# Altium project PCB_Project.PrjPcb (part 2 of 2)

## Sheet Main_Power.SchDoc
size A1; Organization: Protel International P/L; Address1: L3, 12a Rodborough Rd; Address2: Frenchs Forest; Address3: NSW; Address4: Australia 2086
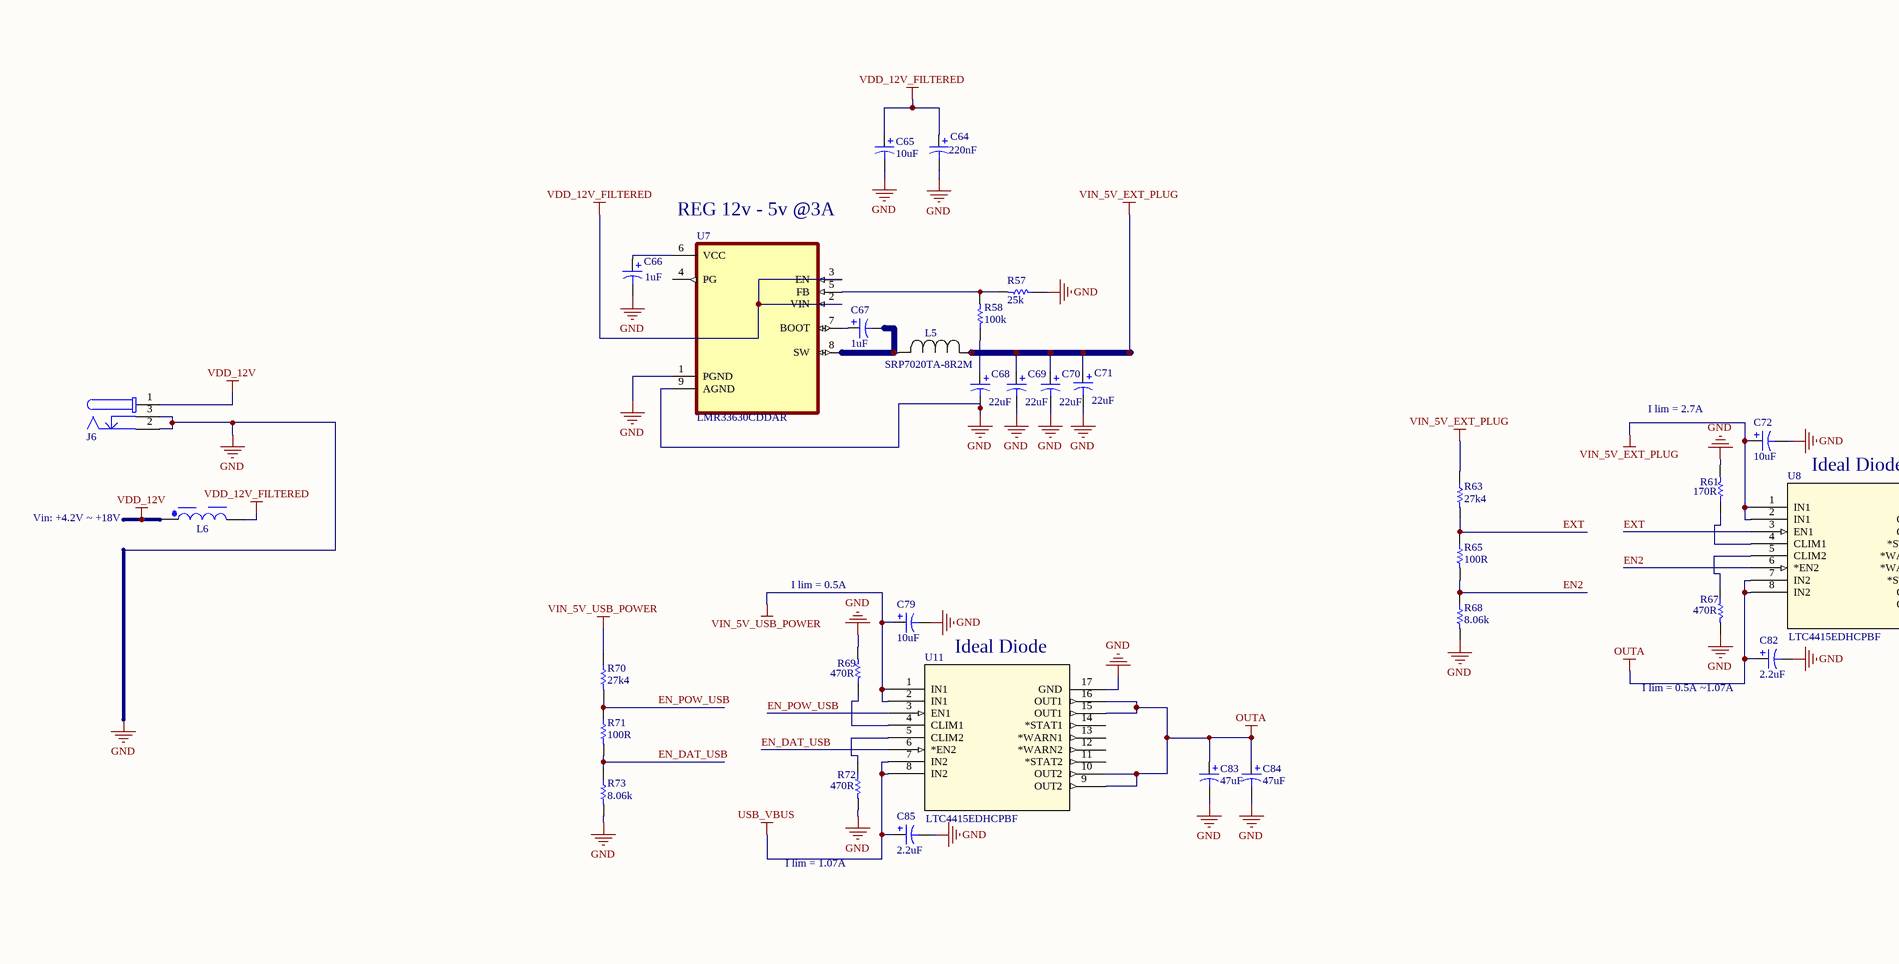
[diagram p7: Main_Power.SchDoc, top left]
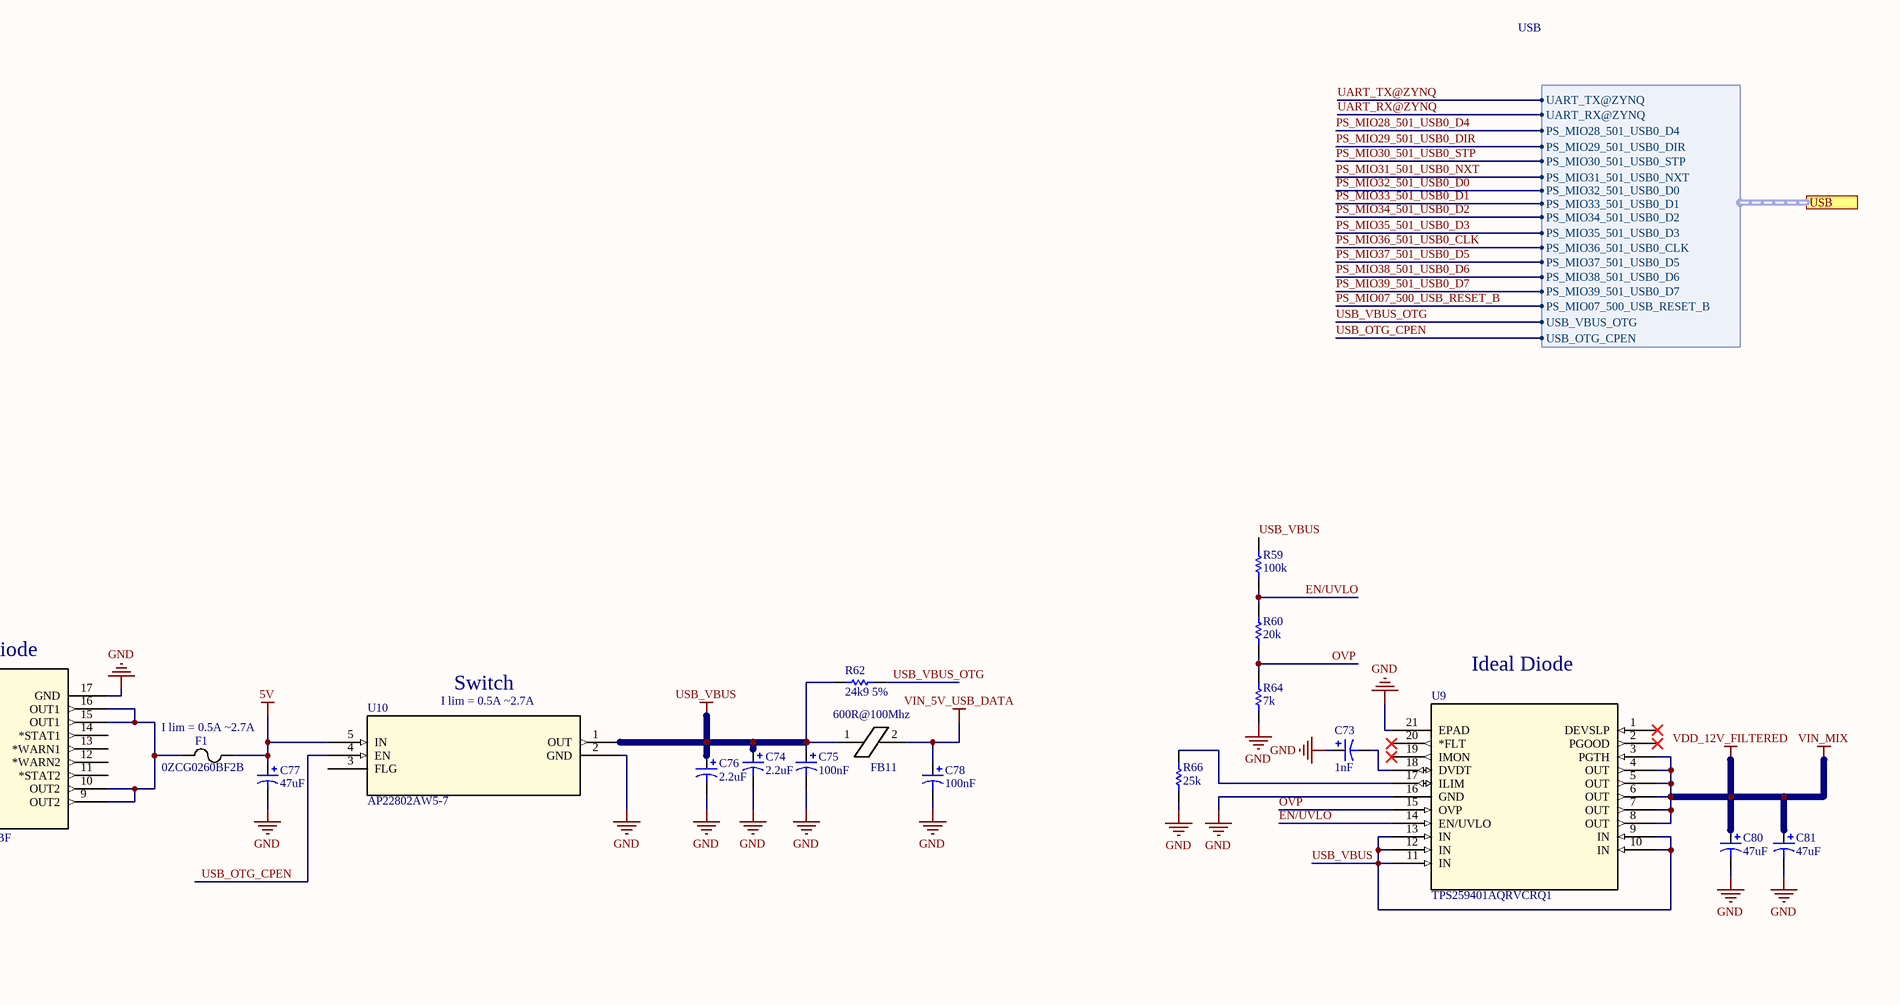
[diagram p8: Main_Power.SchDoc, top right]
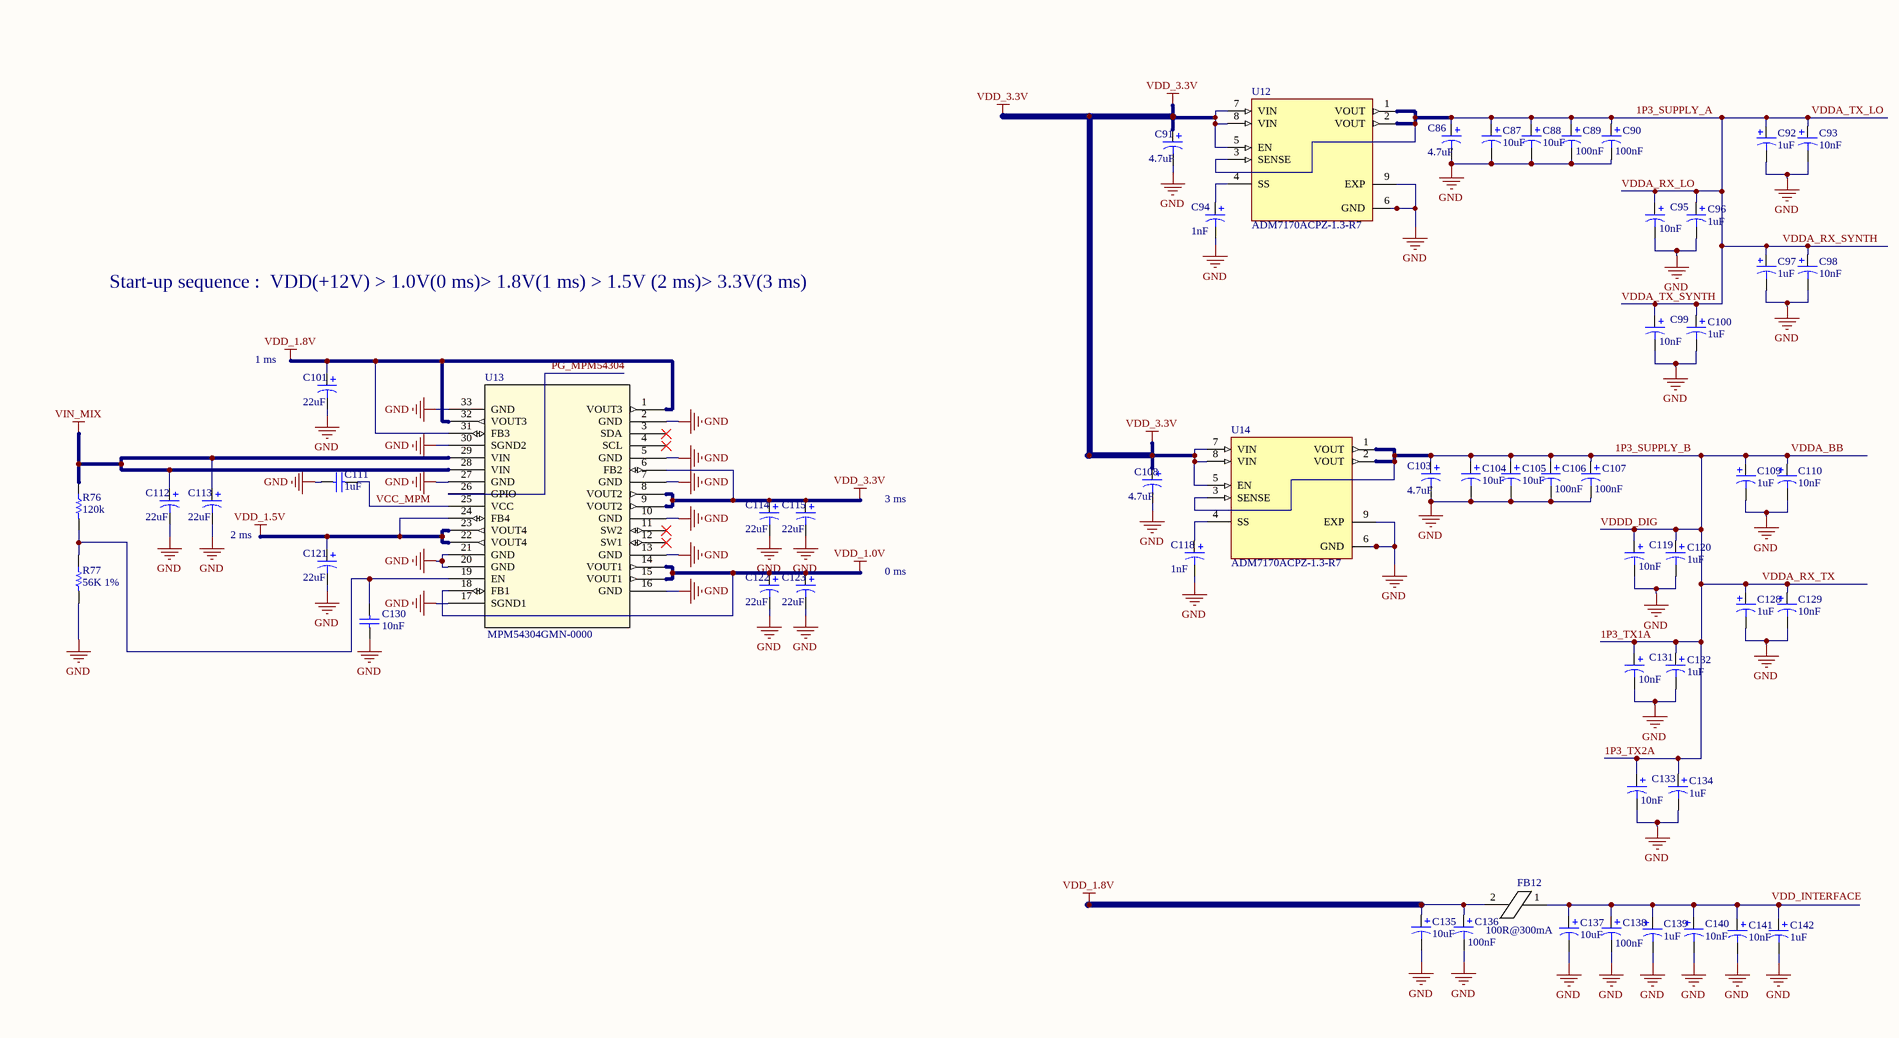
[diagram p9: Main_Power.SchDoc, bottom left]
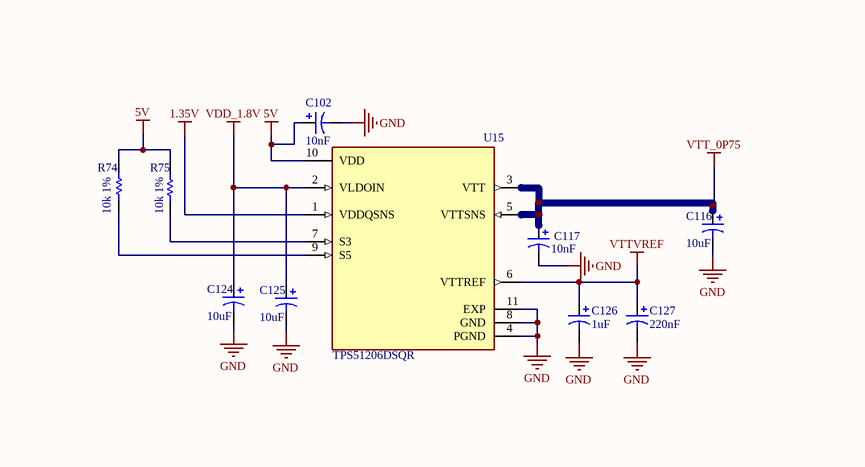
[diagram p10: Main_Power.SchDoc, bottom right]

### Parts
C64  value 220nF  [C0805]  (hidden comment: Pol3)
C65  value 10uF  [C0805]  (hidden comment: Cap Pol3)
C66  value 1uF  [C0805]  (hidden comment: Pol3)
C67  value 1uF  [C0805]  (hidden comment: Pol3)
C68  value 22uF  [C0805]  (hidden comment: Pol3)
C69  value 22uF  [C0805]  (hidden comment: Pol3)
C70  value 22uF  [C0805]  (hidden comment: Pol3)
C71  value 22uF  [C0805]  (hidden comment: Pol3)
C72  value 10uF  [C0805]  (hidden comment: Cap Pol3)
C73  value 1nF  [C0805]  (hidden comment: Cap Pol3)
C74  value 2.2uF  [C0805]  (hidden comment: Cap Pol3)
C75  value 100nF  [C0805]  (hidden comment: Cap Pol3)
C76  value 2.2uF  [C0805]  (hidden comment: Cap Pol3)
C77  value 47uF  [C0805]  (hidden comment: Cap Pol3)
C78  value 100nF  [C0805]  (hidden comment: Cap Pol3)
C79  value 10uF  [C0805]  (hidden comment: Cap Pol3)
C80  value 47uF  [C0805]  (hidden comment: Cap Pol3)
C81  value 47uF  [C0805]  (hidden comment: Cap Pol3)
C82  value 2.2uF  [C0805]  (hidden comment: Cap Pol3)
C83  value 47uF  [C0805]  (hidden comment: Cap Pol3)
C84  value 47uF  [C0805]  (hidden comment: Cap Pol3)
C85  value 2.2uF  [C0805]  (hidden comment: Cap Pol3)
C86  value 4.7uF  [C0805]  (hidden comment: Pol3)
C87  value 10uF  [C0805]  (hidden comment: Cap Pol3)
C88  value 10uF  [C0805]  (hidden comment: Cap Pol3)
C89  value 100nF  [C0805]  (hidden comment: Cap Pol3)
C90  value 100nF  [C0805]  (hidden comment: Cap Pol3)
C91  value 4.7uF  [C0805]  (hidden comment: Pol3)
C92  value 1uF  [C0805]  (hidden comment: Cap Pol3)
C93  value 10nF  [C0805]  (hidden comment: Cap Pol3)
C94  value 1nF  [C0805]  (hidden comment: Pol3)
C95  value 10nF  [C0805]  (hidden comment: Cap Pol3)
C96  value 1uF  [C0805]  (hidden comment: Cap Pol3)
C97  value 1uF  [C0805]  (hidden comment: Cap Pol3)
C98  value 10nF  [C0805]  (hidden comment: Cap Pol3)
C99  value 10nF  [C0805]  (hidden comment: Cap Pol3)
C100  value 1uF  [C0805]  (hidden comment: Cap Pol3)
C101  value 22uF  [C0805]  (hidden comment: Pol3)
C102  value 10nF  [C0805]  (hidden comment: Cap Pol3)
C103  value 4.7uF  [C0805]  (hidden comment: Pol3)
C104  value 10uF  [C0805]  (hidden comment: Cap Pol3)
C105  value 10uF  [C0805]  (hidden comment: Cap Pol3)
C106  value 100nF  [C0805]  (hidden comment: Cap Pol3)
C107  value 100nF  [C0805]  (hidden comment: Cap Pol3)
C108  value 4.7uF  [C0805]  (hidden comment: Pol3)
C109  value 1uF  [C0805]  (hidden comment: Cap Pol3)
C110  value 10nF  [C0805]  (hidden comment: Cap Pol3)
C111  value 1uF  [1608[0603]]
C112  value 22uF  [C0805]  (hidden comment: Pol3)
C113  value 22uF  [C0805]  (hidden comment: Pol3)
C114  value 22uF  [C0805]  (hidden comment: Pol3)
C115  value 22uF  [C0805]  (hidden comment: Pol3)
C116  value 10uF  [C0805]  (hidden comment: Pol3)
C117  value 10nF  [C0805]  (hidden comment: Cap Pol3)
C118  value 1nF  [C0805]  (hidden comment: Pol3)
C119  value 10nF  [C0805]  (hidden comment: Cap Pol3)
C120  value 1uF  [C0805]  (hidden comment: Cap Pol3)
C121  value 22uF  [C0805]  (hidden comment: Pol3)
C122  value 22uF  [C0805]  (hidden comment: Pol3)
C123  value 22uF  [C0805]  (hidden comment: Pol3)
C124  value 10uF  [C0805]  (hidden comment: Pol3)
C125  value 10uF  [C0805]  (hidden comment: Pol3)
C126  value 1uF  [C0805]  (hidden comment: Cap Pol3)
C127  value 220nF  [C0805]  (hidden comment: Cap Pol3)
C128  value 1uF  [C0805]  (hidden comment: Cap Pol3)
C129  value 10nF  [C0805]  (hidden comment: Cap Pol3)
C130  value 10nF  [1608[0603]]
C131  value 10nF  [C0805]  (hidden comment: Cap Pol3)
C132  value 1uF  [C0805]  (hidden comment: Cap Pol3)
C133  value 10nF  [C0805]  (hidden comment: Cap Pol3)
C134  value 1uF  [C0805]  (hidden comment: Cap Pol3)
C135  value 10uF  [C0805]  (hidden comment: Cap Pol3)
C136  value 100nF  [C0805]  (hidden comment: Cap Pol3)
C137  value 10uF  [C0805]  (hidden comment: Cap Pol3)
C138  value 100nF  [C0805]  (hidden comment: Cap Pol3)
C139  value 1uF  [C0805]  (hidden comment: Cap Pol3)
C140  value 10nF  [C0805]  (hidden comment: Cap Pol3)
C141  value 10nF  [C0805]  (hidden comment: Cap Pol3)
C142  value 1uF  [C0805]  (hidden comment: Cap Pol3)
F1  0ZCG0260BF2B  [0ZCG_BEL]
FB11  FERRITA  [0805R]  (value not drawn)
FB12  FERRITA  [0805R]  (value not drawn)
J6  694108301002  [694108301002]  (value not drawn)
L5  SRP7020TA-8R2M  [IND_SRP7020TA-8R2M_BRN]
L6  4.7uH, 2.9A  [WE-PD_7332R]  (value not drawn)
R57  value 25k  [0603]  (hidden comment: Res1)
R58  value 100k  [0603]  (hidden comment: Res1)
R59  value 100k  [0603]  (hidden comment: Res1)
R60  value 20k  [0603]  (hidden comment: Res1)
R61  value 170R  [0603]  (hidden comment: Res1)
R62  value 24k9 5%  [0603]  (hidden comment: Res1)
R63  value 27k4  [0603]  (hidden comment: Res1)
R64  value 7k  [0603]  (hidden comment: Res1)
R65  value 100R  [0603]  (hidden comment: Res1)
R66  value 25k  [0603]  (hidden comment: Res1)
R67  value 470R  [0603]  (hidden comment: Res1)
R68  value 8.06k  [0603]  (hidden comment: Res1)
R69  value 470R  [0603]  (hidden comment: Res1)
R70  value 27k4  [0603]  (hidden comment: Res1)
R71  value 100R  [0603]  (hidden comment: Res1)
R72  value 470R  [0603]  (hidden comment: Res1)
R73  value 8.06k  [0603]  (hidden comment: Res1)
R74  value 10k 1%  [0603]  (hidden comment: Res1)
R75  value 10k 1%  [0603]  (hidden comment: Res1)
R76  value 120k  [0603]  (hidden comment: Res1)
R77  value 56K 1%  [0603]  (hidden comment: Res1)
U7  LMR33630CDDAR  [VREG_LM5017MR/NOPB]
U8  LTC4415EDHCPBF  [05-08-1872_ADI]
U9  TPS259401AQRVCRQ1  [WQFN_3QRVCRQ1_TEX]
U10  AP22802AW5-7  [SOT25_DIO]
U11  LTC4415EDHCPBF  [05-08-1872_ADI]
U12  ADM7170ACPZ-1.3-R7  [SON50P300X300X80-9N]
U13  MPM54304GMN-0000  [LGA7x7x2_MNP]
U14  ADM7170ACPZ-1.3-R7  [SON50P300X300X80-9N]
U15  TPS51206DSQR  [SON40P200X200X80-11N]

### Ports
USB (harness USB)

### Harnesses
USB: PS_MIO29_501_USB0_DIR, PS_MIO28_501_USB0_D4, PS_MIO30_501_USB0_STP, PS_MIO31_501_USB0_NXT, PS_MIO33_501_USB0_D1, PS_MIO32_501_USB0_D0, PS_MIO34_501_USB0_D2, PS_MIO35_501_USB0_D3, PS_MIO37_501_USB0_D5, PS_MIO36_501_USB0_CLK, PS_MIO38_501_USB0_D6, PS_MIO39_501_USB0_D7, PS_MIO07_500_USB_RESET_B, USB_VBUS_OTG, USB_OTG_CPEN, UART_RX@ZYNQ, UART_TX@ZYNQ

### Nets
1.35V: U15.1(VDDQSNS)
5V: C77.1 C102.1 F1.2 R74.2 R75.2 U10.5(IN) U15.10(VDD)
GND: C64.2 C65.2 C66.2 C68.2 C69.2 C70.2 C71.2 C72.2 C73.1 C74.2 C75.2 C76.2 C77.2 C78.2 C79.2 C80.2 C81.2 C82.2 C83.2 C84.2 C85.2 C86.2 C87.2 C88.2 C89.2 C90.2 C91.2 C92.2 C93.2 C94.2 C95.2 C96.2 C97.2 C98.2 C99.2 C100.2 C101.2 C102.2 C103.2 C104.2 C105.2 C106.2 C107.2 C108.2 C109.2 C110.2 C111.2 C112.2 C113.2 C114.2 C115.2 C116.2 C117.2 C118.2 C119.2 C120.2 C121.2 C122.2 C123.2 C124.2 C125.2 C126.2 C127.2 C128.2 C129.2 C130.2 C131.2 C132.2 C133.2 C134.2 C135.2 C136.2 C137.2 C138.2 C139.2 C140.2 C141.2 C142.2 J6.2 J6.3 R57.1 R61.2 R64.2 R66.2 R67.2 R68.2 R69.2 R72.2 R73.2 R77.2 U7.1(PGND) U7.9(AGND) U8.17(GND) U9.16(GND) U9.21(EPAD) U10.2(GND) U11.17(GND) U12.6(GND) U12.9(EXP) U13.2(GND) U13.5(GND) U13.7(GND) U13.10(GND) U13.13(GND) U13.16(GND) U13.17(SGND1) U13.20(GND) U13.21(GND) U13.27(GND) U13.30(SGND2) U13.33(GND) U14.6(GND) U14.9(EXP) U15.4(PGND) U15.8(GND) U15.11(EXP)
OUTA: C82.1 C83.1 C84.1 U8.7(IN2) U8.8(IN2) U11.9(OUT2) U11.10(OUT2) U11.15(OUT1) U11.16(OUT1)
USB_VBUS: C74.1 C75.1 C76.1 C85.1 FB11.1 R59.1 R62.2 U9.9(IN) U9.10(IN) U9.11(IN) U9.12(IN) U9.13(IN) U10.1(OUT) U11.7(IN2) U11.8(IN2)
VDD_1.0V: C122.1 C123.1 U13.14(VOUT1) U13.15(VOUT1) U13.18(FB1)  [project net VCC_INT]
VDD_1.5V: C121.1 U13.22(VOUT4) U13.23(VOUT4) U13.24(FB4)
VDD_1.8V: C101.1 C124.1 C125.1 C135.1 C136.1 FB12.2 U13.1(VOUT3) U13.31(FB3) U13.32(VOUT3) U15.2(VLDOIN)
VDD_3.3V: C91.1 C108.1 C114.1 C115.1 U12.5(EN) U12.7(VIN) U12.8(VIN) U13.6(FB2) U13.8(VOUT2) U13.9(VOUT2) U14.5(EN) U14.7(VIN) U14.8(VIN)
VDD_12V: J6.1 L6.1
VDD_12V_FILTERED: C64.1 C65.1 C80.1 C81.1 C112.1 C113.1 L6.2 R76.1 U7.2(VIN) U7.3(EN) U9.3(PGTH) U9.4(OUT) U9.5(OUT) U9.6(OUT) U9.7(OUT) U9.8(OUT) U13.28(VIN) U13.29(VIN)  [also labelled VIN_MIX]
VIN_5V_EXT_PLUG: C69.1 C70.1 C71.1 C72.1 L5.1 R63.1 U8.1(IN1) U8.2(IN1)
VIN_5V_USB_DATA: C78.1 FB11.2
VIN_5V_USB_POWER: C79.1 R70.1 U11.1(IN1) U11.2(IN1)
VTT_0P75: C116.1 C117.1 U15.3(VTT) U15.5(VTTSNS)
VTTVREF: C126.1 C127.1 U15.6(VTTREF)
1P3_SUPPLY_A: C86.1 C87.1 C88.1 C89.1 C90.1 C92.1 C93.1 C95.1 C96.1 C97.1 C98.1 C99.1 C100.1 U12.1(VOUT) U12.2(VOUT) U12.3(SENSE)  [also labelled VDDA_RX_LO, VDDA_RX_SYNTH, VDDA_TX_LO, VDDA_TX_SYNTH]
1P3_SUPPLY_B: C103.1 C104.1 C105.1 C106.1 C107.1 C109.1 C110.1 C119.1 C120.1 C128.1 C129.1 C131.1 C132.1 C133.1 C134.1 U14.1(VOUT) U14.2(VOUT) U14.3(SENSE)  [also labelled 1P3_TX1A, 1P3_TX2A, VDDA_BB, VDDA_RX_TX, VDDD_DIG]
EN2: R65.2 R68.1 U8.6(*EN2)
EN/UVLO: R59.2 R60.1 U9.14(EN/UVLO)
EN_DAT_USB: R71.2 R73.1 U11.6(*EN2)
EN_POW_USB: R70.2 R71.1 U11.3(EN1)
EXT: R63.2 R65.1 U8.3(EN1)
OVP: R60.2 R64.1 U9.15(OVP)
PG_MPM54304: U13.26(GPIO)
USB_OTG_CPEN: U10.4(EN) ; port USB.USB_OTG_CPEN  [project net USB.USB_OTG_CPEN]
USB_VBUS_OTG: R62.1 ; port USB.USB_VBUS_OTG  [project net USB.USB_VBUS_OTG]
VCC_MPM: C111.1 U13.25(VCC)
NetC66_1: C66.1 U7.6(VCC)
NetC67_1: C67.1 U7.7(BOOT)
NetC67_2: C67.2 L5.2 U7.8(SW)
NetC68_1: C68.1 R58.1
NetC73_2: C73.2 U9.18(DVDT)
NetC94_1: C94.1 U12.4(SS)
NetC118_1: C118.1 U14.4(SS)
NetC130_1: C130.1 R76.2 R77.1 U13.19(EN)
NetC137_1: C137.1 C138.1 C139.1 C140.1 C141.1 C142.1 FB12.1
NetF1_1: F1.1 U8.9(OUT2) U8.10(OUT2) U8.15(OUT1) U8.16(OUT1)
NetR57_2: R57.2 R58.2 U7.5(FB)
NetR61_1: R61.1 U8.4(CLIM1)
NetR66_1: R66.1 U9.17(ILIM)
NetR67_1: R67.1 U8.5(CLIM2)
NetR69_1: R69.1 U11.4(CLIM1)
NetR72_1: R72.1 U11.5(CLIM2)
NetR74_1: R74.1 U15.9(S5)
NetR75_1: R75.1 U15.7(S3)

Not connected (* = marked no-connect by the designer): U7 4(PG); U8 11(*STAT2) 12(*WARN2) 13(*WARN1) 14(*STAT1); U9 1(DEVSLP)* 2(PGOOD)* 19(IMON)* 20(*FLT)*; U10 3(FLG); U11 11(*STAT2) 12(*WARN2) 13(*WARN1) 14(*STAT1); U13 3(SDA)* 4(SCL)* 11(SW2)* 12(SW1)*

### Notes on the sheet
- (near U7) REG 12v - 5v @3A
- I lim = 2.7A
- Ideal Diode
- Vin: +4.2V ~ +18V
- (near F1) I lim = 0.5A ~2.7A
- (near U10) I lim = 0.5A ~2.7A
- (near U10) Switch
- 600R@100Mhz
- I lim = 0.5A
- (near C82) I lim = 0.5A ~1.07A
- I lim = 1.07A
- Start-up sequence :  VDD(+12V) > 1.0V(0 ms)> 1.8V(1 ms) > 1.5V (2 ms)> 3.3V(3 ms)
- 1 ms
- (near C113) 2 ms
- 3 ms
- 0 ms
- 100R@300mA
- Labels drawn without touching a wire or pin: VDD_INTERFACE
- Title
- Size:
- Date:
- File:
- A1
- Number:
- Time:
- Revision:
- Sheet
- of

### Library data of the parts
C64-C110 C112-C129 C131-C142 = Cap Pol3: Polarized Capacitor (Surface Mount); Published: 8-Jun-2000; LatestRevisionDate: 29-May-2009; LatestRevisionNote: IPC-7351 Footprint Added.; PackageReference: C0805; Publisher: Altium Limited; PackageDescription: Chip Capacitor
C111 C130 = Cap Semi: Capacitor (Semiconductor SIM Model); Published: 8-Jun-2000; LatestRevisionDate: 29-May-2009; LatestRevisionNote: IPC-7351 Footprint Added.; PackageReference: C1206; Publisher: Altium Limited; PackageDescription: Chip Capacitor
F1 = 0ZCG0260BF2B: No Description Available; Mfr_Name: Belfuse
J6 = 694108301002: WR-DC DC Power Jack Connector, Male, Right Angled, 24V, 5A; Manufacturer: Wurth Elektronik; Opening Diameter: 6.4mm; Plug Inner Diameter: 2.55mm; Plug Outer Diameter: 5.5mm; ComponentLink1Description: Website Link; ComponentLink1URL: https://www.we-online.com/redexpert/article/694108301002?ad; ComponentLink2Description: Datasheet Link; ComponentLink2URL: https://www.we-online.com/redexpert/spec/694108301002?ad; Manufacturer Part Number: 694108301002; Category: DC Power Jack Connector; Match Code: WR-DC; Mount: Through Hole; Operating Temperature Max: 85°C; Operating Temperature Min: -40°C; Packaging: Bag; Gender: Male; Orientation: Right Angled; Rated Current: 5A; Working Voltage: 24V
L5 = SRP7020TA-8R2M: No Description Available; Mfr_Name: Bourns Electronics
L6 = 7447789004: WE-PD SMT Power Inductor, size 7332R, 4.7uH, 2.9A, 39mOhm; Manufacturer: Wurth Elektronik; DC Resistance: 33mOhm; Saturation Current: 3.9A; Self Resonant Frequency: 45MHz; Type: Robust; Manufacturer Part Number: 7447789004; Category: Power Inductors; Match Code: WE-PD; ComponentLink1Description: Website Link; ComponentLink1URL: https://www.we-online.com/redexpert/article/7447789004?ad; ComponentLink2Description: Datasheet Link; ComponentLink2URL: https://www.we-online.com/redexpert/spec/7447789004?ad; Mount: Surface Mount; Operating Temperature Max: 125°C; Operating Temperature Min: -40°C; Packaging: Tape and Reel; Case/Size Code: 7332R; Length: 7.3mm; Width: 7.3mm; Height: 3.2mm; DC Resistance Max: 39mOhm; Inductance: 4.7uH; Rated Current: 2.9A
R57-R77 = Res1_1: as R1 on sheet ZynQ7xxx; Published: 8-Jun-2000; Revision: July-2002: Re-released for DXP Platform.; Publisher: Altium Limited; Class II: Resistor; REF FARNELL 1206 SMD 510R: 4387065; REF FARNELL 1206 SMD 1K: 912475; REF FARNELL 1206 SMD 10K: 912591; REF FARNELL 0603 SMD: 612-595
U7 = LMR33630CDDAR: SIMPLE SWITCHER 3.8V to 36V, 3A Synchronous Buck Converter With Ultra-Low EMI 8-SO PowerPAD -40 to 125; MF: Texas Instruments; MP: LMR33630CDDAR; Package: HSOIC-8 Texas Instruments; Purchase-URL: https://pricing.snapeda.com/search/part/LMR33630CDDAR/?ref=eda; Check_prices: https://www.snapeda.com/parts/LMR33630CDDAR/Texas%20Instruments/view-part/2725482/?ref=eda; SnapEDA_Link: https://www.snapeda.com/parts/LMR33630CDDAR/Texas%20Instruments/view-part/2725482/?ref=snap; Price: None; Availability: Warning; Value: *
U8 U11 = LTC4415EDHCPBF: No Description Available; Mfr_Name: Analog Devices Inc; Type: Power Management; RefDes: RefDes
U9 = TPS259401AQRVCRQ1: No Description Available; Mfr_Name: Texas Instruments; Type: Power Management; RefDes: RefDes
U10 = AP22802AW5-7: No Description Available; Mfr_Name: Diodes Inc; RefDes: RefDes; Type: Type
U12 U14 = ADM7170ACPZ-1.3-R7: 6.5 V, 500 mA, Ultralow Noise, High PSRR, Fast Transient Response CMOS LDO; MF: Analog Devices; SnapEDA_Link: https://www.snapeda.com/parts/ADM7170ACPZ-1.3-R7/Analog+Devices/view-part/?ref=snap; Package: LFCSP -8 Analog Devices; Value: *; MP: ADM7170ACPZ-1.3-R7; Check_prices: https://www.snapeda.com/parts/ADM7170ACPZ-1.3-R7/Analog+Devices/view-part/?ref=eda
U13 = MPM54304GMN-0000: No Description Available; Mfr_Name: Monolithic Power Systems; RefDes: RefDes; Type: Type
U15 = TPS51206DSQR: 2A Peak Sink/Source DDR Termination Regulator with VTTREF Buffered Reference for DDR2/3/3L/4 10-WSON -40 to 105; MF: Texas Instruments; Texas_Instruments-Purchase-URL: https://snapeda.com/shop?store=Texas+Instruments&id=449732; Value: *; Availability: Good; Price: None; MP: TPS51206DSQR; DigiKey-Purchase-URL: https://snapeda.com/shop?store=DigiKey&id=449732; Package: WSON-10 Texas Instruments; SnapEDA_Link: https://www.snapeda.com/parts/TPS51206DSQR/Texas%20Instruments/view-part/449732/?ref=snap; Mouser-Purchase-URL: https://snapeda.com/shop?store=Mouser&id=449732
FB11 FB12 = FERRITA: CODIGO DIGIKEY: *; CODIGO FARNELL: *; CODIGO MOUSER: *; CODIGO PRODUCTO: *; DISTRIBUIDOR 1: *; DISTRIBUIDOR 2: *

## Sheet USB INTERFACES.SchDoc
size A1; Organization: Protel International P/L; Address1: L3, 12a Rodborough Rd; Address2: Frenchs Forest; Address3: NSW; Address4: Australia 2086
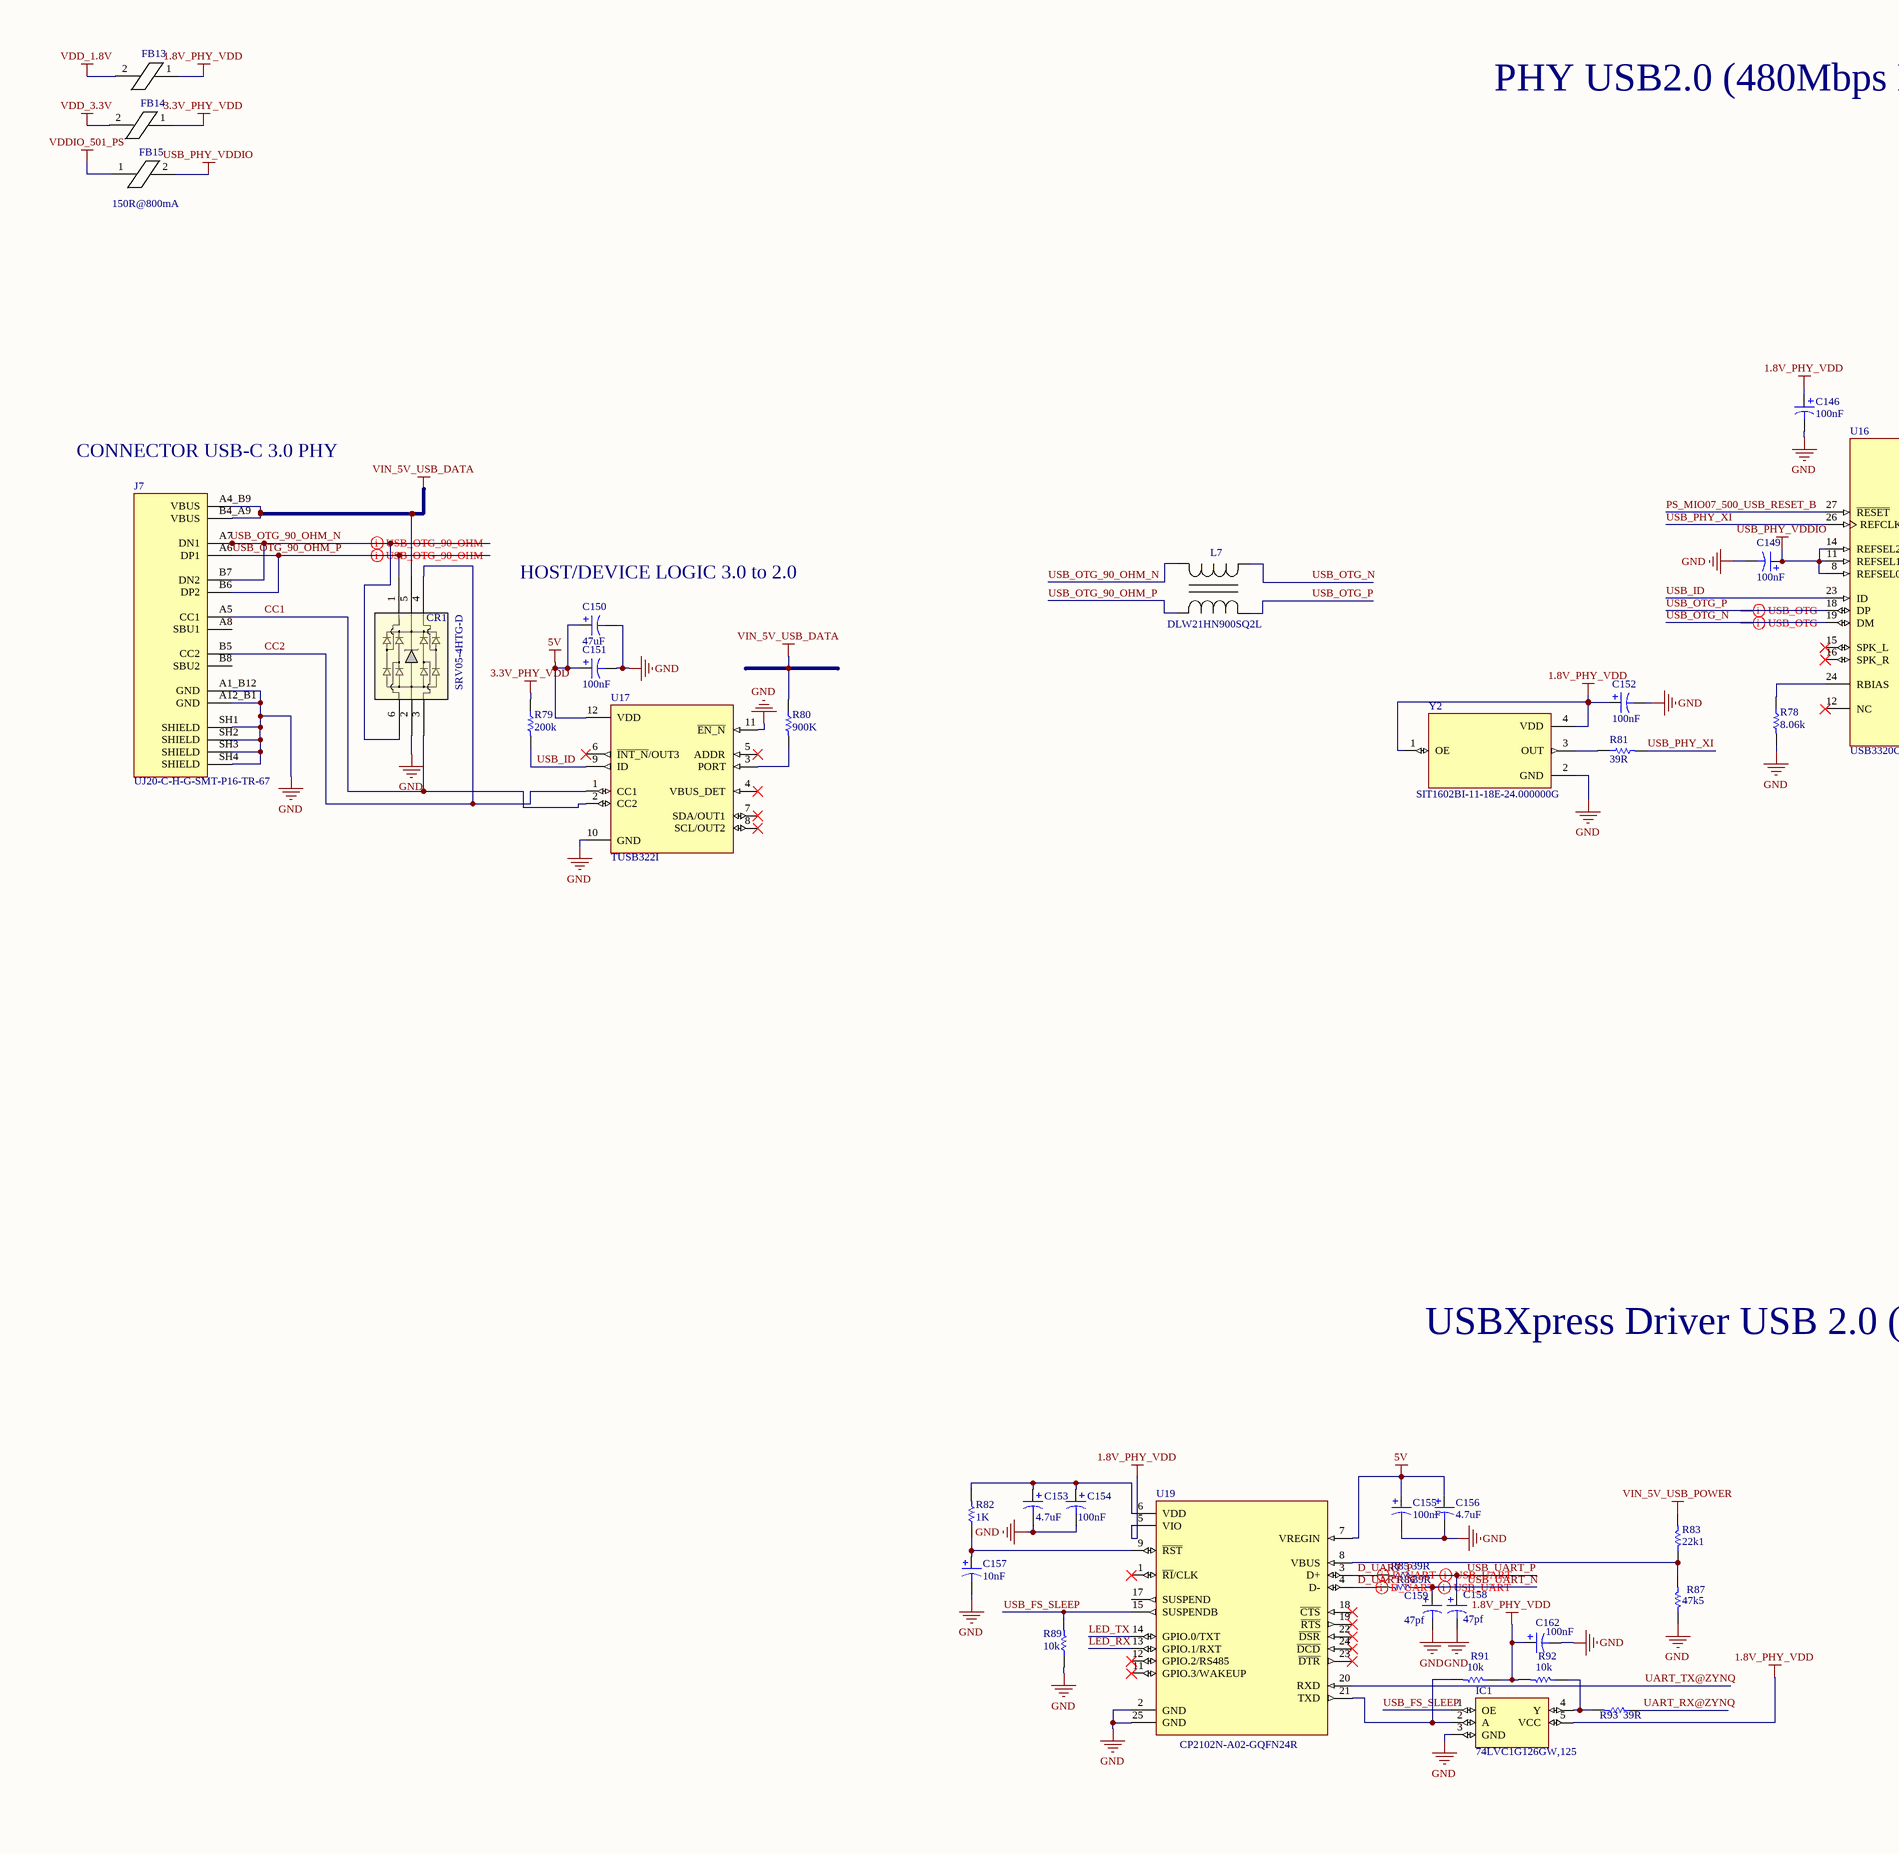
[diagram p11: USB INTERFACES.SchDoc, left]
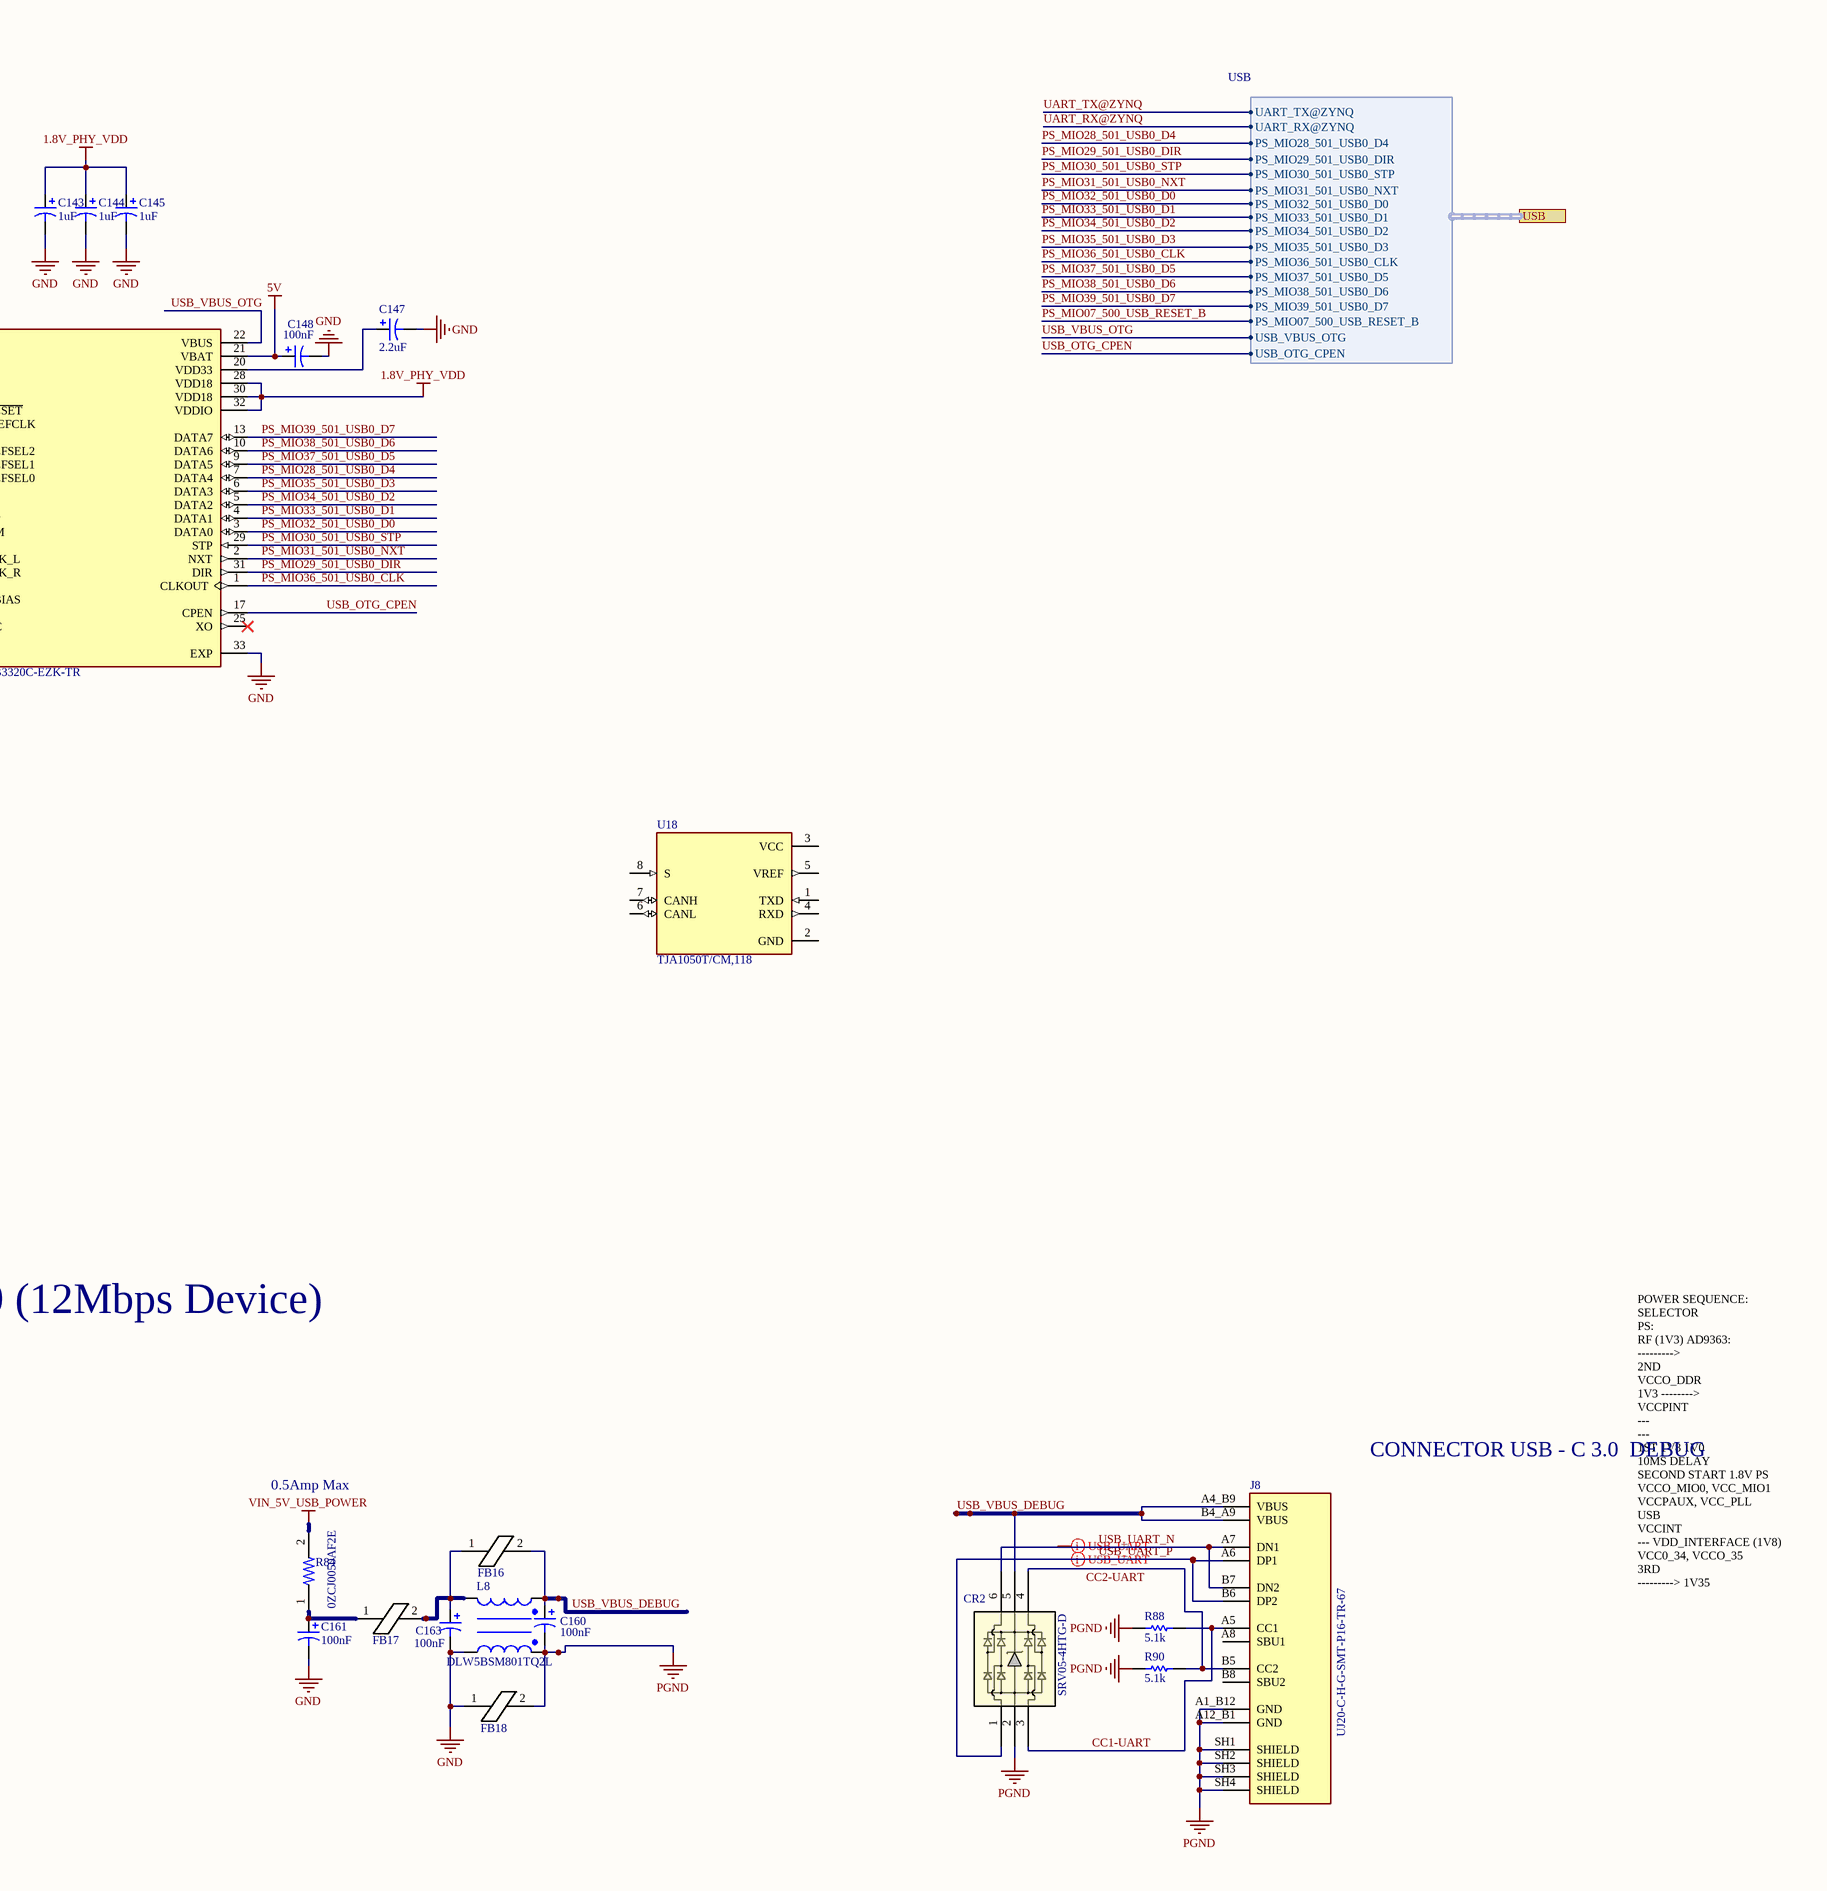
[diagram p12: USB INTERFACES.SchDoc, right]

### Parts
C143  value 1uF  [C0805]  (hidden comment: Cap Pol3)
C144  value 1uF  [C0805]  (hidden comment: Cap Pol3)
C145  value 1uF  [C0805]  (hidden comment: Cap Pol3)
C146  value 100nF  [C0805]  (hidden comment: Cap Pol3)
C147  value 2.2uF  [C0805]  (hidden comment: Cap Pol3)
C148  value 100nF  [C0805]  (hidden comment: Cap Pol3)
C149  value 100nF  [C0805]  (hidden comment: Cap Pol3)
C150  value 47uF  [C0805]  (hidden comment: Cap Pol3)
C151  value 100nF  [C0805]  (hidden comment: Cap Pol3)
C152  value 100nF  [C0805]  (hidden comment: Cap Pol3)
C153  value 4.7uF  [C0805]  (hidden comment: Cap Pol3)
C154  value 100nF  [C0805]  (hidden comment: Cap Pol3)
C155  value 100nF  [C0805]  (hidden comment: Cap Pol3)
C156  value 4.7uF  [C0805]  (hidden comment: Cap Pol3)
C157  value 10nF  [C0805]  (hidden comment: Cap Pol3)
C158  value 47pf  [C0805]  (hidden comment: Cap Pol3)
C159  value 47pf  [C0805]  (hidden comment: Cap Pol3)
C160  value 100nF  [C0805]  (hidden comment: Cap Pol3)
C161  value 100nF  [C0805]  (hidden comment: Cap Pol3)
C162  value 100nF  [C0805]  (hidden comment: Cap Pol3)
C163  value 100nF  [C0805]  (hidden comment: Cap Pol3)
CR1  SRV05-4HTG-D  [SOIC6_SOT23-6_CRA_LTF]
CR2  SRV05-4HTG-D  [SOIC6_SOT23-6_CRA_LTF]
FB13  FERRITA  [0805R]  (value not drawn)
FB14  FERRITA  [0805R]  (value not drawn)
FB15  FERRITA  [0805R]  (value not drawn)
FB16  FERRITA  [0805R]  (value not drawn)
FB17  FERRITA  [0805R]  (value not drawn)
FB18  FERRITA  [0805R]  (value not drawn)
IC1  74LVC1G126GW,125  [SOT65P212X110-5N]
J7  UJ20-C-H-G-SMT-P16-TR-67  [SAMESKY_UJ20-C-H-G-SMT-P16-TR-67]
J8  UJ20-C-H-G-SMT-P16-TR-67  [SAMESKY_UJ20-C-H-G-SMT-P16-TR-67]
L7  DLW21HN900SQ2L  [IND_DLW21H_0805_MUR]
L8  DLW5BSM801TQ2L  [FIL_DLW5BSM801TQ2L]
R78  value 8.06k  [0603]  (hidden comment: Res1)
R79  value 200k  [0603]  (hidden comment: Res1)
R80  value 900K  [0603]  (hidden comment: Res1)
R81  value 39R  [0603]  (hidden comment: Res1)
R82  value 1K  [0603]  (hidden comment: Res1)
R83  value 22k1  [0603]  (hidden comment: Res1)
R84  0ZCJ0050AF2E  [RESC3216X125N]
R85  value 39R  [0603]  (hidden comment: Res1)
R86  value 39R  [0603]  (hidden comment: Res1)
R87  value 47k5  [0603]  (hidden comment: Res1)
R88  value 5.1k  [0603]  (hidden comment: Res1)
R89  value 10k  [0603]  (hidden comment: Res1)
R90  value 5.1k  [0603]  (hidden comment: Res1)
R91  value 10k  [0603]  (hidden comment: Res1)
R92  value 10k  [0603]  (hidden comment: Res1)
R93  value 39R  [0603]  (hidden comment: Res1)
U16  USB3320C-EZK-TR  [QFN50P500X500X100-33N]
U17  TUSB322I  [IC_TUSB320IRWBR]
U18  TJA1050T/CM,118  [SOIC127P600X175-8N]
U19  CP2102N-A02-GQFN24R  [QFN50P400X400X80-25N]
Y2  SIT1602BI-11-18E-24.000000G  [OSC_SIT1602BI-11-18E-24.000000G]

### Ports
USB (harness USB)

### Harnesses
USB: PS_MIO29_501_USB0_DIR, PS_MIO28_501_USB0_D4, PS_MIO30_501_USB0_STP, PS_MIO31_501_USB0_NXT, PS_MIO33_501_USB0_D1, PS_MIO32_501_USB0_D0, PS_MIO34_501_USB0_D2, PS_MIO35_501_USB0_D3, PS_MIO37_501_USB0_D5, PS_MIO36_501_USB0_CLK, PS_MIO38_501_USB0_D6, PS_MIO39_501_USB0_D7, PS_MIO07_500_USB_RESET_B, USB_VBUS_OTG, USB_OTG_CPEN, UART_RX@ZYNQ, UART_TX@ZYNQ

### Nets
1.8V_PHY_VDD: C143.1 C144.1 C145.1 C146.1 C152.1 C162.1 FB13.1 IC1.5(VCC) R91.1 R92.2 U16.28(VDD18) U16.30(VDD18) U16.32(VDDIO) U19.5(VIO) Y2.1(OE) Y2.4(VDD)
3.3V_PHY_VDD: FB14.1 R79.1
5V: C148.1 C150.1 C151.1 C155.1 C156.1 U16.21(VBAT) U17.12(VDD) U19.7(VREGIN)
GND: C143.2 C144.2 C145.2 C146.2 C147.2 C148.2 C149.2 C150.2 C151.2 C152.2 C153.2 C154.2 C155.2 C156.2 C157.2 C158.2 C159.2 C161.2 C162.2 C163.2 CR1.2 FB18.1 IC1.3(GND) J7.A1_B12(GND) J7.A12_B1(GND) J7.SH1(SHIELD) J7.SH2(SHIELD) J7.SH3(SHIELD) J7.SH4(SHIELD) L8.3 R78.2 R87.1 R89.1 U16.33(EXP) U17.10(GND) U17.11(~{EN_N}) U19.2(GND) U19.25(GND) Y2.2(GND)
PGND: C160.2 CR2.2 FB18.2 J8.A1_B12(GND) J8.A12_B1(GND) J8.SH1(SHIELD) J8.SH2(SHIELD) J8.SH3(SHIELD) J8.SH4(SHIELD) L8.4 R88.1 R90.1
USB_PHY_VDDIO: C149.1 FB15.2 U16.8(REFSEL0) U16.11(REFSEL1) U16.14(REFSEL2)
VDD_1.8V: FB13.2
VDD_3.3V: FB14.2
VDDIO_501_PS: FB15.1
VIN_5V_USB_DATA: CR1.5 J7.A4_B9(VBUS) J7.B4_A9(VBUS) R80.1
VIN_5V_USB_POWER: R83.2 R84.2
CC1: CR1.3 J7.A5(CC1) U17.2(CC2)
CC1-UART: CR2.3 J8.A5(CC1) R88.2
CC2: CR1.4 J7.B5(CC2) U17.1(CC1)
CC2-UART: CR2.4 J8.B5(CC2) R90.2
D_UART_N: R86.2 U19.4(D-)
D_UART_P: R85.2 U19.3(D+)
LED_RX: U19.13(GPIO.1/RXT)
LED_TX: U19.14(GPIO.0/TXT)
PS_MIO07_500_USB_RESET_B: U16.27(~{RESET}) ; port USB.PS_MIO07_500_USB_RESET_B
PS_MIO28_501_USB0_D4: U16.7(DATA4) ; port USB.PS_MIO28_501_USB0_D4
PS_MIO29_501_USB0_DIR: U16.31(DIR) ; port USB.PS_MIO29_501_USB0_DIR
PS_MIO30_501_USB0_STP: U16.29(STP) ; port USB.PS_MIO30_501_USB0_STP
PS_MIO31_501_USB0_NXT: U16.2(NXT) ; port USB.PS_MIO31_501_USB0_NXT
PS_MIO32_501_USB0_D0: U16.3(DATA0) ; port USB.PS_MIO32_501_USB0_D0
PS_MIO33_501_USB0_D1: U16.4(DATA1) ; port USB.PS_MIO33_501_USB0_D1
PS_MIO34_501_USB0_D2: U16.5(DATA2) ; port USB.PS_MIO34_501_USB0_D2
PS_MIO35_501_USB0_D3: U16.6(DATA3) ; port USB.PS_MIO35_501_USB0_D3
PS_MIO36_501_USB0_CLK: U16.1(CLKOUT) ; port USB.PS_MIO36_501_USB0_CLK
PS_MIO37_501_USB0_D5: U16.9(DATA5) ; port USB.PS_MIO37_501_USB0_D5
PS_MIO38_501_USB0_D6: U16.10(DATA6) ; port USB.PS_MIO38_501_USB0_D6
PS_MIO39_501_USB0_D7: U16.13(DATA7) ; port USB.PS_MIO39_501_USB0_D7
UART_RX@ZYNQ: R93.1 ; port USB.UART_RX@ZYNQ
UART_TX@ZYNQ: U19.20(RXD) ; port USB.UART_TX@ZYNQ
USB_FS_SLEEP: IC1.1(OE) R89.2 U19.15(SUSPENDB)
USB_ID: R79.2 U16.23(ID) U17.9(ID)
USB_OTG_90_OHM_N: CR1.6 J7.A7(DN1) J7.B7(DN2) L7.1
USB_OTG_90_OHM_P: CR1.1 J7.A6(DP1) J7.B6(DP2) L7.4
USB_OTG_CPEN: U16.17(CPEN) ; port USB.USB_OTG_CPEN  [project net USB.USB_OTG_CPEN]
USB_OTG_N: L7.2 U16.19(DM)
USB_OTG_P: L7.3 U16.18(DP)
USB_PHY_XI: R81.2 U16.26(REFCLK)
USB_UART_N: C159.1 CR2.6 J8.A7(DN1) J8.B7(DN2) R86.1
USB_UART_P: C158.1 CR2.1 J8.A6(DP1) J8.B6(DP2) R85.1
USB_VBUS_DEBUG: C160.1 CR2.5 FB16.2 J8.A4_B9(VBUS) J8.B4_A9(VBUS) L8.1
USB_VBUS_OTG: U16.22(VBUS) ; port USB.USB_VBUS_OTG  [project net USB.USB_VBUS_OTG]
NetC147_1: C147.1 U16.20(VDD33)
NetC153_1: C153.1 C154.1 R82.2 U19.6(VDD)
NetC157_1: C157.1 R82.1 U19.9(~{RST})
NetC161_1: C161.1 FB17.1 R84.1
NetC163_1: C163.1 FB16.1 FB17.2 L8.2
NetIC1_2: IC1.2(A) R91.2 U19.21(TXD)
NetIC1_4: IC1.4(Y) R92.1 R93.2
NetR78_1: R78.1 U16.24(RBIAS)
NetR80_2: R80.2 U17.3(PORT)
NetR81_1: R81.1 Y2.3(OUT)
NetR83_1: R83.1 R87.2 U19.8(VBUS)

Not connected (* = marked no-connect by the designer): J7 A8(SBU1) B8(SBU2); J8 A8(SBU1) B8(SBU2); U16 12(NC)* 15(SPK_L)* 16(SPK_R)* 25(XO)*; U17 4(VBUS_DET)* 5(ADDR)* 6(~{INT_N}/OUT3)* 7(SDA/OUT1)* 8(SCL/OUT2)*; U18 1(TXD) 2(GND) 3(VCC) 4(RXD) 5(VREF) 6(CANL) 7(CANH) 8(S); U19 1(~{RI}/CLK)* 11(GPIO.3/WAKEUP)* 12(GPIO.2/RS485)* 17(SUSPEND) 18(~{CTS})* 19(~{RTS})* 22(~{DSR})* 23(~{DTR})* 24(~{DCD})*

### Layout directives
differential pair: (no net found under the mark), D_UART_N, D_UART_P, USB_OTG_90_OHM_N, USB_OTG_90_OHM_P, USB_OTG_N, USB_OTG_P, USB_UART_N, USB_UART_P

### Notes on the sheet
- PHY USB2.0 (480Mbps Host - Device)
- (near FB15) 150R@800mA
- (near J7) CONNECTOR USB-C 3.0 PHY
- (near C150) HOST/DEVICE LOGIC 3.0 to 2.0
- USBXpress Driver USB 2.0 (12Mbps Device)
- 0.5Amp Max
- (near J8) CONNECTOR USB - C 3.0  DEBUG
- POWER SEQUENCE:
  SELECTOR
  PS:
  RF (1V3) AD9363:
  --------->
  2ND
  VCCO_DDR
  1V3 -------->
  VCCPINT
  ---
  ---
  1ST 1V8 1V0
  10MS DELAY
  SECOND START 1.8V PS
  VCCO_MIO0, VCC_MIO1
  VCCPAUX, VCC_PLL
  USB
  VCCINT
  --- VDD_INTERFACE (1V8)
  VCC0_34, VCCO_35
  3RD
  ---------> 1V35
- Title
- Size:
- Date:
- File:
- A1
- Number:
- Time:
- Revision:
- Sheet
- of

### Library data of the parts
C143-C163 = Cap Pol3: Polarized Capacitor (Surface Mount); Published: 8-Jun-2000; LatestRevisionDate: 29-May-2009; LatestRevisionNote: IPC-7351 Footprint Added.; PackageReference: C0805; Publisher: Altium Limited; PackageDescription: Chip Capacitor
CR1 CR2 = SRV05-4HTG-D: No Description Available; Mfr_Name: Littelfuse Inc; RefDes: RefDes; Type: Type
IC1 = 74LVC1G126GW,125: Buffer, Non-Inverting 1 Element 1 Bit per Element 3-State Output 5-TSSOP; MF: Nexperia USA Inc.; SnapEDA_Link: https://www.snapeda.com/parts/74LVC1G126GW,125/Nexperia/view-part/?ref=snap; Package: None; Value: *; MP: 74LVC1G126GW,125; Check_prices: https://www.snapeda.com/parts/74LVC1G126GW,125/Nexperia/view-part/?ref=eda
L7 = DLW21HN900SQ2L: No Description Available; Mfr_Name: Murata
L8 = DLW5BSM801TQ2L: 2 Line Common Mode Choke Surface Mount 800 Ohms @ 100MHz 2A DCR 56mOhm; MF: Murata; Value: *; SnapEDA_Link: https://www.snapeda.com/parts/DLW5BSM801TQ2L/Murata/view-part/4300902/?ref=snap; MP: DLW5BSM801TQ2L; Package: Horizontal-4 Murata; DigiKey-Purchase-URL: https://snapeda.com/shop?store=DigiKey&id=4300902; Digi-Key_Part_Number: 490-9569-1-ND
R78-R83 R85-R93 = Res1_1: Resistor; Manufacturer: Generic Components; Class I: Passive; Published: 8-Jun-2000; Revision: July-2002: Re-released for DXP Platform.; Publisher: Altium Limited; Class II: Resistor; REF FARNELL 1206 SMD 510R: 4387065; REF FARNELL 1206 SMD 1K: 912475; REF FARNELL 1206 SMD 10K: 912591; REF FARNELL 0603 SMD: 612-595
R84 = 0ZCJ0050AF2E: 1206 SMT PPTC | 0.50 Ih | 24V; MF: Bel Fuse; Availability: Unavailable; Price: None; Package: 1206 Bel Fuse; MP: 0ZCJ0050AF2E; Value: *; SnapEDA_Link: https://www.snapeda.com/parts/0ZCJ0050AF2E/Bel%20Fuse%20Inc./view-part/1301170/?ref=snap
U16 = USB3320C-EZK-TR: Microchip USB3320C-EZK-TR, USB Transceiver, USB 2.0, 1.8 V, 3.3 V, 32-Pin QFN | Microchip Technology Inc. USB3320C-EZK-TR; SnapEDA_Link: https://www.snapeda.com/parts/USB3320C-EZK-TR/Microchip/view-part/?ref=snap; Package: QFN-32 Microchip; Value: *; MF: Microchip; MP: USB3320C-EZK-TR; Check_prices: https://www.snapeda.com/parts/USB3320C-EZK-TR/Microchip/view-part/?ref=eda
U17 = TUSB320IRWBR: USB Type-C configuration channel logic and port control; MF: Texas Instruments; SnapEDA_Link: https://www.snapeda.com/parts/TUSB320IRWBR/Texas+Instruments/view-part/?ref=snap; Package: X2QFN-12 Texas Instruments; Value: *; MP: TUSB320IRWBR; Check_prices: https://www.snapeda.com/parts/TUSB320IRWBR/Texas+Instruments/view-part/?ref=eda
U18 = TJA1050T/CM,118: 1/1 Transceiver Half CANbus 8-SO; MF: NXP USA; SnapEDA_Link: https://www.snapeda.com/parts/TJA1050T/CM,118/NXP%20USA%20Inc./view-part/304529/?ref=snap; Value: *; Purchase-URL: https://pricing.snapeda.com/search/part/TJA1050T/CM,118/?ref=eda; Check_prices: https://www.snapeda.com/parts/TJA1050T/CM,118/NXP%20USA%20Inc./view-part/304529/?ref=eda; Price: None; Availability: In Stock; MP: TJA1050T/CM,118; Package: SO-8 NXP Semiconductors
Y2 = SIT1602BI-11-18E-24.000000G: Oscillator MEMS 24MHz Â±20ppm (Stability) 15pF HCMOS/LVCMOS 55% 1.8V 4-Pin PQFN SMD T/R; MF: SiTime; SnapEDA_Link: https://www.snapeda.com/parts/SIT1602BI-11-18E-24.000000G/SiTime/view-part/?ref=snap; Package: None; Value: *; MP: SIT1602BI-11-18E-24.000000G; Check_prices: https://www.snapeda.com/parts/SIT1602BI-11-18E-24.000000G/SiTime/view-part/?ref=eda
FB13-FB18 = FERRITA: CODIGO DIGIKEY: *; CODIGO FARNELL: *; CODIGO MOUSER: *; CODIGO PRODUCTO: *; DISTRIBUIDOR 1: *; DISTRIBUIDOR 2: *
J7 J8 = UJ20-C-H-G-SMT-P16-TR-67: Package: None; Price: None; Value: *; MP: UJ20-C-H-G-SMT-P16-TR-67; Availability: Unavailable
U19 = CP2102N-A02-GQFN24R: Value: *; MP: CP2102N-A02-GQFN24R; Package: None; Availability: Unavailable; Price: None

## Nets that join several sheets
1.35V: ZynQ7xxx (15 pins), DDR3 (19 pins), Main_Power (U15.1)
5V: ZynQ7xxx (D1.A D2.A), Main_Power (7 pins), USB INTERFACES (8 pins)
GND: ZynQ7xxx (86 pins), DDR3 (35 pins), RF (88 pins), Main_Power (116 pins), USB INTERFACES (39 pins)
VCC_INT: ZynQ7xxx (17 pins), Main_Power (5 pins)
VDD_1.8V: ZynQ7xxx (13 pins), DDR3 (C44.1 R21.2 R22.2 U4.8), Main_Power (10 pins), USB INTERFACES (FB13.2)
VDD_3.3V: Main_Power (13 pins), USB INTERFACES (FB14.2)
VDDIO_501_PS: ZynQ7xxx (10 pins), USB INTERFACES (FB15.1)
VIN_5V_USB_DATA: Main_Power (C78.1 FB11.2), USB INTERFACES (CR1.5 J7.A4_B9 J7.B4_A9 R80.1)
VIN_5V_USB_POWER: Main_Power (C79.1 R70.1 U11.1 U11.2), USB INTERFACES (R83.2 R84.2)
VTT_0P75: DDR3 (25 pins), Main_Power (C116.1 C117.1 U15.3 U15.5)
VTTVREF: DDR3 (6 pins), Main_Power (C126.1 C127.1 U15.6)
CONTROL&CLOCKS.IO_02_34_AD9361_RST: ZynQ7xxx (U1.P9), RF (U6.K5)
CONTROL&CLOCKS.IO_L01_34_FB_CLK: ZynQ7xxx (U1.P10), RF (U6.F10)
CONTROL&CLOCKS.IO_L08_34_CTRL_OUT0: ZynQ7xxx (U1.L15), RF (U6.D4)
CONTROL&CLOCKS.IO_L08_34_CTRL_OUT1: ZynQ7xxx (U1.M15), RF (U6.E4)
CONTROL&CLOCKS.IO_L09_34_TX_FRAME: ZynQ7xxx (U1.L14), RF (U6.G9)
CONTROL&CLOCKS.IO_L10_34_EN_AGC: ZynQ7xxx (U1.L13), RF (U6.G5)
CONTROL&CLOCKS.IO_L11_34_ENABLE: ZynQ7xxx (U1.K12), RF (U6.G6)
CONTROL&CLOCKS.IO_L11_34_TXNRX: ZynQ7xxx (U1.K11), RF (U6.H4)
CONTROL&CLOCKS.IO_L13_34_CTRL_OUT2: ZynQ7xxx (U1.N11), RF (U6.E5)
CONTROL&CLOCKS.IO_L13_34_CTRL_OUT3: ZynQ7xxx (U1.N12), RF (U6.E6)
CONTROL&CLOCKS.IO_L21_34_CTRL_OUT4: ZynQ7xxx (U1.M10), RF (U6.F6)
CONTROL&CLOCKS.IO_L21_34_CTRL_OUT5: ZynQ7xxx (U1.M11), RF (U6.F5)
CONTROL&CLOCKS.IO_L22_34_CTRL_OUT6: ZynQ7xxx (U1.N7), RF (U6.F4)
CONTROL&CLOCKS.IO_L22_34_CTRL_OUT7: ZynQ7xxx (U1.N8), RF (U6.G4)
CTRL_IN0: ZynQ7xxx (U1.F13), RF (U6.C5)
CTRL_IN1: ZynQ7xxx (U1.F14), RF (U6.C6)
CTRL_IN2: ZynQ7xxx (U1.G15), RF (U6.D6)
CTRL_IN3: ZynQ7xxx (U1.F15), RF (U6.D5)
IO_L23_35_SPI_CLK: ZynQ7xxx (U1.E11), RF (U6.J5)
IO_L23_35_SPI_ENB: ZynQ7xxx (U1.E12), RF (U6.K6)
IO_L24_35_SPI_DI: ZynQ7xxx (U1.E13), RF (U6.J4)
IO_L24_35_SPI_DO: ZynQ7xxx (U1.F12), RF (U6.L6)
PS_MIO01_500_QSPI0_SS_B: ZynQ7xxx (U1.A5), DDR3 (R21.1 U4.1)
PS_MIO02_500_QSPI0_IO0: ZynQ7xxx (U1.A8), DDR3 (R25.2 U4.5)
PS_MIO03_500_QSPI0_IO1: ZynQ7xxx (U1.A7), DDR3 (R23.2 U4.2)
PS_MIO04_500_QSPI0_IO2: ZynQ7xxx (U1.C8), DDR3 (R24.2 U4.3)
PS_MIO05_500_QSPI0_IO3: ZynQ7xxx (P2.3 U1.A9), DDR3 (R22.1 U4.7)
PS_MIO06_500_QSPI0_SCLK: ZynQ7xxx (U1.A10), DDR3 (R26.2 U4.6)
PS_MIO07_500_USB_RESET_B: ZynQ7xxx (R18.2 U1.A12), USB INTERFACES (U16.27)
PS_MIO28_501_USB0_D4: ZynQ7xxx (U1.A15), USB INTERFACES (U16.7)
PS_MIO29_501_USB0_DIR: ZynQ7xxx (U1.D11), USB INTERFACES (U16.31)
PS_MIO30_501_USB0_STP: ZynQ7xxx (U1.B15), USB INTERFACES (U16.29)
PS_MIO31_501_USB0_NXT: ZynQ7xxx (U1.C12), USB INTERFACES (U16.2)
PS_MIO32_501_USB0_D0: ZynQ7xxx (U1.E15), USB INTERFACES (U16.3)
PS_MIO33_501_USB0_D1: ZynQ7xxx (U1.C11), USB INTERFACES (U16.4)
PS_MIO34_501_USB0_D2: ZynQ7xxx (U1.D15), USB INTERFACES (U16.5)
PS_MIO35_501_USB0_D3: ZynQ7xxx (U1.A14), USB INTERFACES (U16.6)
PS_MIO36_501_USB0_CLK: ZynQ7xxx (U1.B14), USB INTERFACES (U16.1)
PS_MIO37_501_USB0_D5: ZynQ7xxx (U1.C14), USB INTERFACES (U16.9)
PS_MIO38_501_USB0_D6: ZynQ7xxx (U1.A13), USB INTERFACES (U16.10)
PS_MIO39_501_USB0_D7: ZynQ7xxx (U1.D14), USB INTERFACES (U16.13)
RX_D0_N: ZynQ7xxx (U1.H14), RF (U6.K11)
RX_D0_P: ZynQ7xxx (U1.J13), RF (U6.J12)
RX_D1_N: ZynQ7xxx (U1.G14), RF (U6.K10)
RX_D1_P: ZynQ7xxx (U1.H13), RF (U6.J11)
RX_D2_N: ZynQ7xxx (U1.G12), RF (U6.K9)
RX_D2_P: ZynQ7xxx (U1.H12), RF (U6.J10)
RX_D3_N: ZynQ7xxx (U1.G11), RF (U6.K8)
RX_D3_P: ZynQ7xxx (U1.J14), RF (U6.J9)
RX_D4_N: ZynQ7xxx (U1.J15), RF (U6.K7)
RX_D4_P: ZynQ7xxx (U1.K15), RF (U6.J8)
RX_D5_N: ZynQ7xxx (U1.H11), RF (U6.J7)
RX_D5_P: ZynQ7xxx (U1.J11), RF (U6.H8)
TX_D0_N: ZynQ7xxx (U1.P15), RF (U6.E12)
TX_D0_P: ZynQ7xxx (U1.R13), RF (U6.D11)
TX_D1_N: ZynQ7xxx (U1.R15), RF (U6.E11)
TX_D1_P: ZynQ7xxx (U1.P11), RF (U6.D10)
TX_D2_N: ZynQ7xxx (U1.R11), RF (U6.E10)
TX_D2_P: ZynQ7xxx (U1.R12), RF (U6.D9)
TX_D3_N: ZynQ7xxx (U1.P14), RF (U6.E9)
TX_D3_P: ZynQ7xxx (U1.P13), RF (U6.D8)
TX_D4_N: ZynQ7xxx (U1.N9), RF (U6.E8)
TX_D4_P: ZynQ7xxx (U1.M9), RF (U6.D7)
TX_D5_N: ZynQ7xxx (U1.R8), RF (U6.F8)
TX_D5_P: ZynQ7xxx (U1.R7), RF (U6.E7)
UART_RX@ZYNQ: ZynQ7xxx (P2.1 U1.C6), USB INTERFACES (R93.1)
UART_TX@ZYNQ: ZynQ7xxx (P2.2 U1.B7), USB INTERFACES (U19.20)
USB.USB_OTG_CPEN: Main_Power (U10.4), USB INTERFACES (U16.17)
USB.USB_VBUS_OTG: Main_Power (R62.1), USB INTERFACES (U16.22)